# EAGLE design ATTAMI-V0.00 (EAGLE 7.2.0)
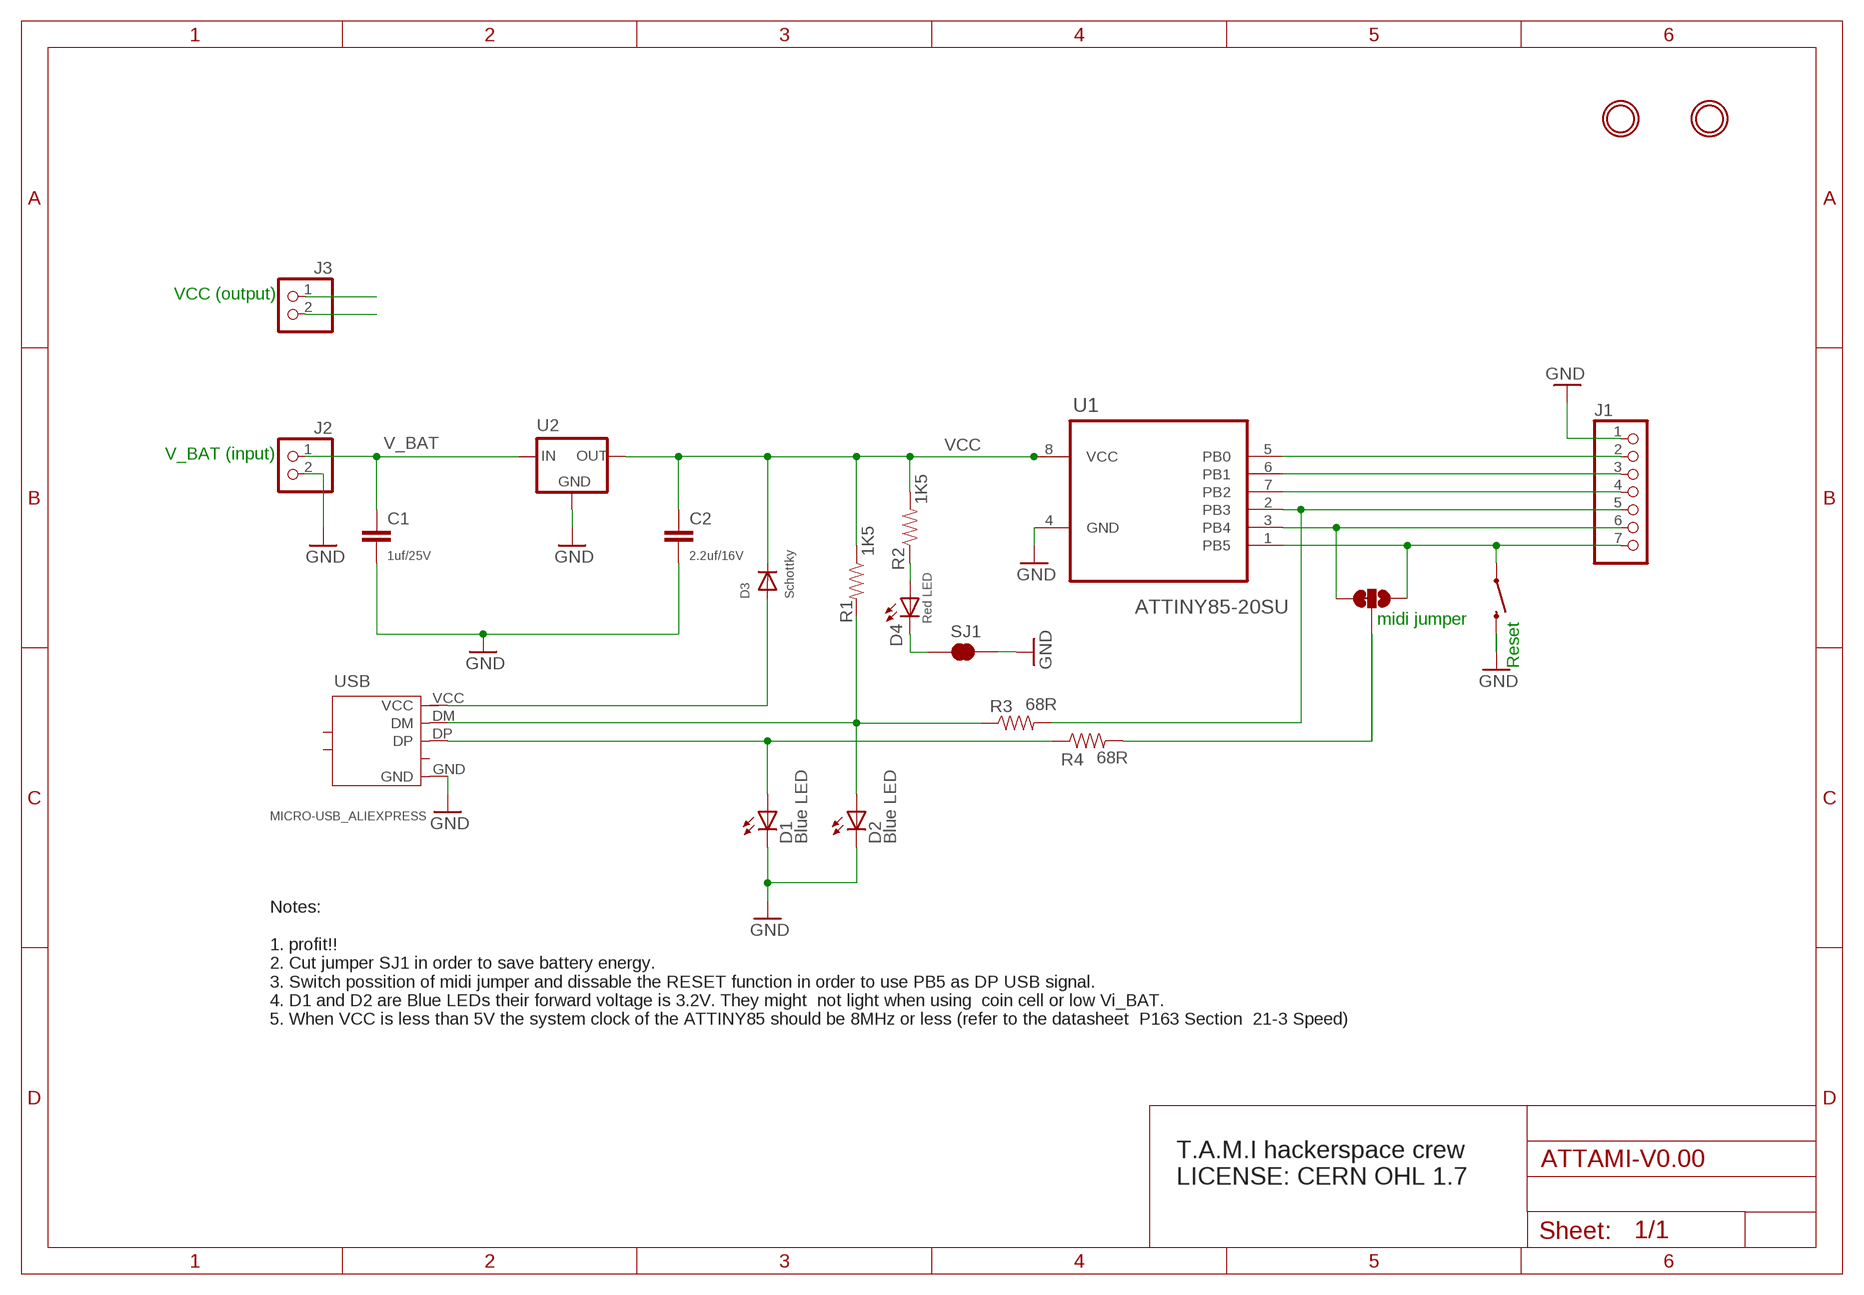
[diagram p0: schematic, sheet 1]

## Parts
C1  1uf/25V  CAP0805  [0805]
C2  2.2uf/16V  CAP0805  [0805]
D1  Blue LED  LED-0805  [LED-805]
D2  Blue LED  LED-0805  [LED-805]
D3  Schottky  SCHOTTKY-DIODESOD-323  [SOD-323]
D4  Red LED  LED-0805  [LED-805]
J1  HEADER-1X7ROUND  [1X07_ROUND]
J2  HEADER-1X2ROUND  [1X02_ROUND]
J3  HEADER-1X2ROUND  [1X02_ROUND]
MIDI  JUMPER-PAD-3-2OF3_NC_BY_TRACE_SMALL  [PAD-JUMPER-3-2OF3_NC_BY_TRACE_YES_SILK_FULL_BOX]
R1  1K5  RESISTOR0805-RES  [0805]
R2  1K5  RESISTOR0805-RES  [0805]
R3  68R  RESISTOR0805-RES  [0805]
R4  68R  RESISTOR0805-RES  [0805]
S1  SWITCH-MOMENTARY-2-SMD-1101NE  [TACTILE-SWITCH-1101NE]
SJ1  JUMPER-PAD-2-NC_BY_TRACE  [PAD-JUMPER-2-NC_BY_TRACE_YES_SILK]
U1  ATTINY85-20SU  [SOIC127P798X216-8N]
U2  XXX1117SOT-232  [SOT-223]
U$1  MOUNTINGHOLE2.0  [MOUNTINGHOLE_2.0_PLATED]
U$2  MOUNTINGHOLE2.0  [MOUNTINGHOLE_2.0_PLATED]
USB  MICRO-USB_ALIEXPRESS  [USB-MICRO-ALIEXPRESS]

## Nets
GND: C1.2 C2.2 D1.C D2.C J1.1 J2.2 J3.2 S1.P$2 SJ1.1 U1.4(GND) U2.1(GND) USB.GND
N$1: MIDI.2 R4.2
N$7: D1.A R4.1 USB.DP
N$10: D2.A R1.2 R3.1 USB.DM
N$11: D4.A R2.1
N$13: D4.C SJ1.2
PB0: J1.2 U1.5(PB0)
PB1: J1.3 U1.6(PB1)
PB2: J1.4 U1.7(PB2)
PB3: J1.5 R3.2 U1.2(PB3)
PB4: J1.6 MIDI.3 U1.3(PB4)
PB5: J1.7 MIDI.1 S1.P$1 U1.1(PB5)
V-BUS: D3.AQ(A) USB.VCC
V_BAT: C1.1 J2.1 U2.3(IN)
VCC: C2.1 D3.CQ(C) J3.1 R1.1 R2.2 U1.8(VCC) U2.2(OUT) U2.4(OUT)

## Notes on the sheet
- VCC (output)
- V_BAT (input)
- midi jumper | Reset
- Notes: 
  
  1. profit!!
  2. Cut jumper SJ1 in order to save battery energy.
  3. Switch possition of midi jumper and dissable the RESET function in order to use PB5 as DP USB signal.
  4. D1 and D2 are Blue LEDs their forward voltage is 3.2V. They might  not light when using  coin cell or low Vi_BAT.
  5. When VCC is less than 5V the system clock of the ATTINY85 should be 8MHz or less (refer to the datasheet  P163 Section  21-3 Speed)
- T.A.M.I hackerspace crew 
  LICENSE: CERN OHL 1.7

## Library data of the parts
C1 C2 = ATtami:CAP: Capacitor Standard 0603 ceramic capacitor, and 0.1" leaded capacitor.
D1 D2 D4 = ATtami:LED: Light Emitting Diode
D3 = ATtami:SCHOTTKY-DIODE: Schottky Diode
J1 = ATtami:HEADER-1X7: PIN HEADER
J2 J3 = ATtami:HEADER-1X2: PIN HEADER
MIDI = SparkFun-Passives:JUMPER-PAD-3-2OF3_NC_BY_TRACE
R1-R4 = ATtami:RESISTOR: Resistor Basic schematic elements and footprints for 0603, 1206, and PTH resistors.
S1 = ATtami:SWITCH-MOMENTARY-2: Various NO switches- pushbuttons, reed, etc
SJ1 = SparkFun-Passives:JUMPER-PAD-2-NC_BY_TRACE
U1 = ATtami:ATTINY85-20SU: 8-bit Microcontroller with In-System Programmable Flash; MPN: ATTINY85-20SU; OC_FARNELL: 1455164; OC_NEWARK: 58M3797; PACKAGE: SOIC-8; SUPPLIER: Atmel
U2 = ATtami:XXX1117: VOLTAGE REGULATOR
U$1 U$2 = ATtami:MOUNTINGHOLE: Mounting Hole For #2 screws (0.086"/2.18mm width, 0.094"/2.4mm hole) use 2.5mm
USB = ATtami:MICRO-USB_ALIEXPRESS

## Net classes
0 default: width 0.203 mm
1 vcc: width 0.254 mm

## Board
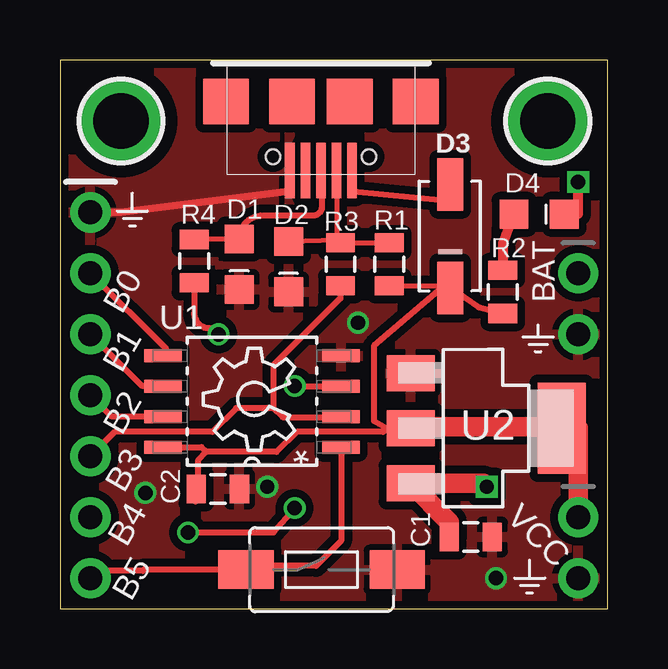
[diagram p1: board, top side]
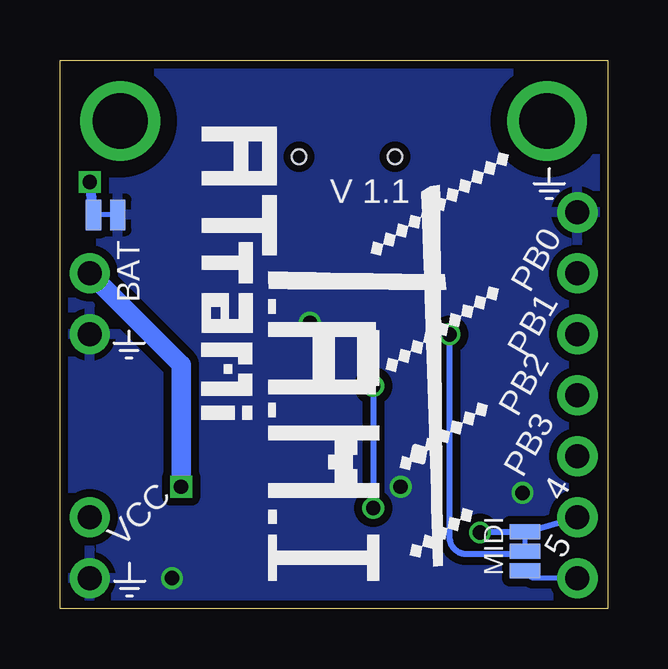
[diagram p2: board, bottom side, seen from below]

Size 22.83 x 22.86 mm. Coordinates in mm from the lower left corner, seen from the top.
Outline: 0,0 22.83,0 22.83,22.86 0,22.86 0,0
Copper layers (1*16): Top 0.035mm / dielectric 1.5mm / Bottom 0.035mm
Design rules "Elecrow_2-layer_eagle_rule": minimum track width 6mil, minimum drill 12mil, track to track 6mil, track to pad 6mil, pad to pad 6mil, via to via 6mil, smd to smd 0mil, copper to edge 10mil, drill to drill 10mil, minimum pad ring 10mil, minimum via ring 6mil, stop-mask expansion 2mil, vias tented up to drill 100mil, thermal gap 10mil

### Footprints (pad centres in the part's own frame; a part is rotated, then mirrored left to right if it is on the bottom)
0805 = smd 0.8 x 1.2: 1 -0.9,0; 2 0.9,0
LED-805 = smd 1.2 x 1.2: A 0,1.05; C 0,-1.05
SOD-323 = smd 2.184 x 1.067: AQ 2.159,0; CQ -2.159,0
1X07_ROUND = drill 1 pad 1.676: 1 -7.62,0; 2 -5.08,0; 3 -2.54,0; 4 0,0; 5 2.54,0; 6 5.08,0; 7 7.62,0
1X02_ROUND = drill 1 pad 1.676: 1 -1.27,0; 2 1.27,0
PAD-JUMPER-3-2OF3_NC_BY_TRACE_YES_SILK_FULL_BOX = smd 0.635 x 1.27: 1 -0.813,0; 2 0,0; 3 0.813,0
TACTILE-SWITCH-1101NE = smd 2.3 x 1.6: P$1 -3.15,0; P$2 3.15,0
PAD-JUMPER-2-NC_BY_TRACE_YES_SILK = smd 0.635 x 1.27: 1 -0.508,0; 2 0.508,0
SOIC127P798X216-8N = smd 1.549 x 0.533: 1 -3.708,1.905; 2 -3.708,0.635; 3 -3.708,-0.635; 4 -3.708,-1.905; 5 3.708,-1.905; 6 3.708,-0.635; 7 3.708,0.635; 8 3.708,1.905
SOT-223 = smd 1.5 x 2: 1 -2.3,-3.15; 2 0,-3.15; 3 2.3,-3.15 | smd 3.8 x 2: 4 0,3.15
MOUNTINGHOLE_2.0_PLATED = drill 2.3 pad 3: P$1 0,0
USB-MICRO-ALIEXPRESS = smd 0.4 x 2.3: DM -0.65,1.925; DP 0,1.925; GND 1.3,1.925; NC05 0.65,1.925; VCC -1.3,1.925 | smd 1.9 x 1.9: NC01 -3.95,-0.95; NC02 -1.2,-0.95; NC03 1.2,-0.95; NC04 3.95,-0.95 | hole 0.6: -2,1.35; 2,1.35

### Placement (x,y rotation side)
C1  17.11,2.99 0 top
C2  6.58,4.99 0 top
D1  7.47,14.35 0 top
D2  9.53,14.25 0 top
D3  16.26,15.52 90 top
D4  19.96,16.44 90 top
J1  1.27,8.89 270 top
J2  21.59,12.7 270 top
J3  21.59,2.54 270 top
MIDI  3.45,2.39 90 bottom
R1  13.72,14.35 90 top
R2  18.45,13.2 270 top
R3  11.68,14.35 270 top
R4  5.59,14.48 270 top
S1  10.9,1.63 0 top
SJ1  20.93,16.41 180 bottom
U1  8,8.64 180 top
U2  17.75,7.52 270 top
U$1  2.54,20.32 270 top
U$2  20.32,20.32 0 top
U$3  [OSHW_6X150_NOTEXT]  9.78,6.6 90 top
USB  10.87,20.18 180 top

### Tracks (layer width: path | path; a pad name or v marks a point on that pad's centre or on a via)
GND  (via drill 0.6)
  Top 0.203: USB.GND 9.53,18.25 9.53,17.4
  Top 0.305: 9.53,17.4 2.54,16.51 J1.1
  other vias: 3.56,4.83 8.64,5.08 12.42,11.91 18.16,1.27
  pour Bottom (isolate 0.33): 23.37,23.75 -1.52,23.62 -1.21,-1.43 23.37,-1.02
  pour Top (isolate 0.33): -1.02,23.5 -1.02,-0.51 23.62,-0.51 23.3,23.53
N$1  (via drill 0.6 pad 0.25)
  Top 0.254: R4.2 5.59,12.32 arc90 6.22,11.68 6.35,11.68 arc-90 v6.6,11.43
  Bottom 0.254: v6.6,11.43 6.6,3.05 arc-90 5.97,2.29 3.56,2.29 arc-90 MIDI.2
N$7
  Top 0.203: D1.A 5.61,15.4 R4.1
  Top 0.254: D1.A arc-90 8.45,16.38 10.54,16.38 arc90 10.92,16.76 10.92,17.4 arc-90 10.87,17.45 USB.DP
N$10
  Top 0.203: USB.DM 11.52,15.41 R3.1 | R3.1 R1.2 | D2.A 11.56,15.38 R3.1
N$11
  Top 0.406: D4.A 18.45,15.23 R2.1
N$13  (via drill 0.6)
  Top 0.406: D4.C 21.59,16.44 v21.59,17.78
  Bottom 0.406: v21.59,17.78 21.61,17.78 SJ1.2
PB0
  Top 0.254: U1.5 4.42,10.82 J1.2
PB1
  Top 0.254: U1.6 3.43,9.27 J1.3
PB2
  Top 0.254: U1.7 2.16,8 J1.4
PB3
  Top 0.254: R3.2 11.68,12.93 8.89,10.13 8.89,8.36 | 8.89,8.36 9.27,7.98 11.68,7.98 U1.2 | 8.89,8.36 7.34,8.36 6.35,7.37 2.29,7.37 J1.5
PB4  (via drill 0.6)
  Top 0.254: v9.78,9.27 U1.3 | v5.33,3.17 8.89,3.17 v9.78,4.19
  Bottom 0.203: 3.43,3.17 MIDI.3
  Bottom 0.254: 3.43,3.17 J1.6 | v9.78,9.27 v9.78,4.19 | v5.33,3.17 5.31,3.2 MIDI.3
PB5
  Top 0.254: S1.P$1 7.11,1.63 | 7.11,1.63 3.5,1.63 MIDI.1 1.57,1.57 J1.7 | U1.1 11.71,2.82 10.67,1.78 7.26,1.78 7.11,1.63
  Bottom 0.203: J1.7 3.15,1.27 MIDI.1
V-BUS
  Top 0.254: USB.VCC 12.19,17.4 16,17.02 D3.AQ
V_BAT  (via drill 0.6)
  Top 0.813: v17.78,5.08 17.64,5.22 U2.3 16.21,3.61 C1.1
  Bottom 0.813: J2.1 17.78,10.16 v17.78,5.08
VCC
  Top 0.203: R1.1 15.92,13.45 D3.CQ
  Top 0.254: R2.2 17.47,12.54 D3.CQ 15.9,13.36 13.08,10.95 13.08,7.82 14.05,7.26 14.78,7.26 U2.2 13.61,7.52 13.46,7.37 9.86,7.37 9.02,6.53 6.1,6.53 | 6.1,6.53 5.74,6.17 5.74,4.57 5.64,4.47 5.64,4.95 C2.1 | U1.8 5.89,6.73 6.1,6.53
  Top 0.61: 14.78,7.26 14.78,7.32 15.04,7.57 | 20.85,7.57 U2.4 21.59,7.52
  Top 0.813: 15.04,7.57 20.85,7.57 | 21.59,7.52 J3.1

### Text on the board
bPlace: V 1.1 | BAT | PB0 | PB1 | PB2 | PB3 | 4 | VCC | 5
tNames: BAT | B0 | B1 | B2 | B3 | B4 | VCC | B5
tTest: J2